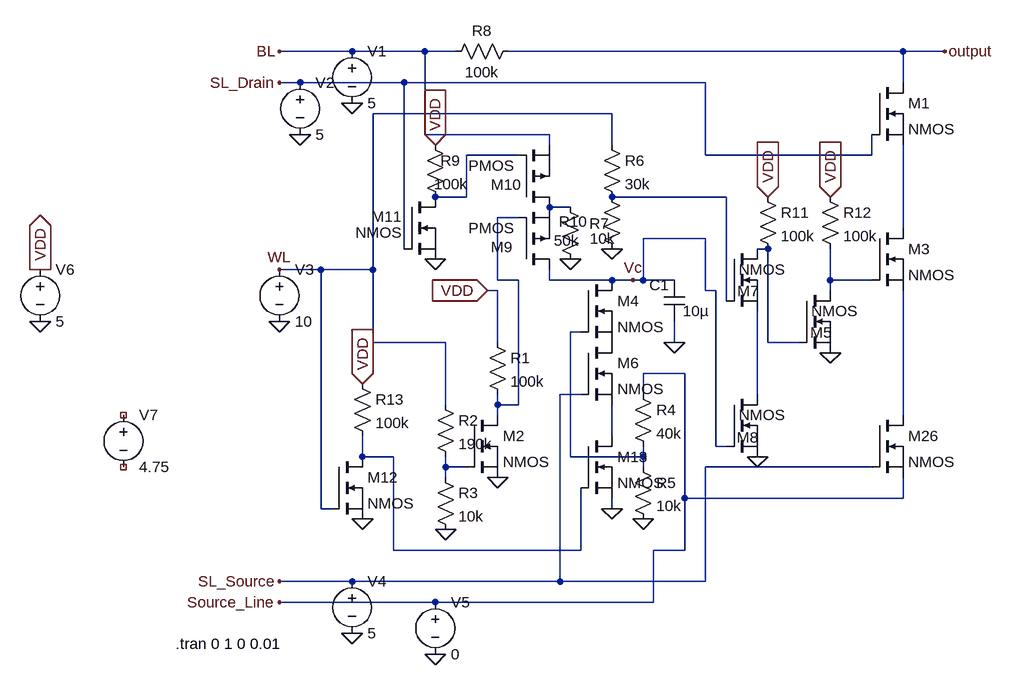
[diagram p0: schematic nand_flash_corrected.asc]
nand_flash_corrected.asc, the LTspice schematic file:
Version 4
SHEET 1 1140 836
WIRE -672 -112 -784 -112
WIRE -560 -112 -672 -112
WIRE -512 -112 -560 -112
WIRE 176 -112 -432 -112
WIRE 240 -112 176 -112
WIRE -752 -64 -784 -64
WIRE -592 -64 -752 -64
WIRE -128 -64 -592 -64
WIRE 176 -64 176 -112
WIRE -272 -16 -640 -16
WIRE -560 16 -560 -112
WIRE -368 16 -560 16
WIRE -368 32 -368 16
WIRE -272 32 -272 -16
WIRE -416 48 -496 48
WIRE -128 48 -128 -64
WIRE 128 48 128 16
WIRE 128 48 -128 48
WIRE -496 112 -496 48
WIRE -496 112 -544 112
WIRE -96 112 -272 112
WIRE -336 128 -368 128
WIRE -416 144 -448 144
WIRE 176 160 176 32
WIRE -128 176 -224 176
WIRE -592 192 -592 -64
WIRE -32 192 -48 192
WIRE -720 224 -784 224
WIRE -640 224 -640 -16
WIRE -640 224 -720 224
WIRE -448 240 -448 144
WIRE -416 240 -448 240
WIRE -368 240 -368 224
WIRE -272 240 -368 240
WIRE -240 240 -272 240
WIRE -224 240 -224 176
WIRE -224 240 -240 240
WIRE -176 240 -224 240
WIRE 64 240 64 192
WIRE 128 240 64 240
WIRE -448 256 -464 256
WIRE -128 256 -128 176
WIRE -112 256 -128 256
WIRE 64 256 64 240
WIRE -96 272 -96 112
WIRE -320 320 -336 320
WIRE -640 336 -640 224
WIRE -528 336 -640 336
WIRE -448 336 -448 256
WIRE -176 336 -176 304
WIRE -32 336 -32 192
WIRE 16 336 -32 336
WIRE -160 384 -224 384
WIRE -320 416 -352 416
WIRE -224 416 -224 384
WIRE -48 416 -48 288
WIRE -528 432 -528 336
WIRE -448 432 -448 416
WIRE -416 432 -416 240
WIRE -416 432 -448 432
WIRE -448 448 -448 432
WIRE 176 448 176 256
WIRE -272 480 -272 432
WIRE -112 496 -112 256
WIRE -96 496 -112 496
WIRE -656 512 -656 480
WIRE -608 512 -656 512
WIRE -336 512 -336 320
WIRE -224 512 -224 496
WIRE -224 512 -336 512
WIRE -528 528 -528 512
WIRE -496 528 -528 528
WIRE -224 528 -224 512
WIRE 128 528 -128 528
WIRE -528 544 -528 528
WIRE -160 576 -160 384
WIRE 176 576 176 544
WIRE 176 576 -160 576
WIRE -720 592 -720 224
WIRE -704 592 -720 592
WIRE -272 592 -272 576
WIRE -608 656 -608 512
WIRE -320 656 -320 560
WIRE -320 656 -608 656
WIRE -160 656 -160 576
WIRE -160 656 -208 656
WIRE -672 704 -784 704
WIRE -352 704 -352 416
WIRE -352 704 -672 704
WIRE -128 704 -128 528
WIRE -128 704 -352 704
WIRE -544 736 -784 736
WIRE -208 736 -208 656
WIRE -208 736 -544 736
FLAG -176 336 0
FLAG -464 256 VDD
IOPIN -464 256 In
FLAG -448 544 0
FLAG -528 624 0
FLAG -224 608 0
FLAG -272 192 0
FLAG -784 -112 BL
FLAG -784 224 WL
FLAG -784 -64 SL_Drain
FLAG -784 704 SL_Source
FLAG -784 736 Source_Line
FLAG -672 -32 0
FLAG -752 16 0
FLAG -784 304 0
FLAG -672 784 0
FLAG -544 816 0
FLAG -1152 304 0
FLAG -1152 224 VDD
IOPIN -1152 224 Out
FLAG -48 512 0
FLAG 64 352 0
FLAG -32 112 VDD
IOPIN -32 112 In
FLAG 64 112 VDD
IOPIN 64 112 In
FLAG 240 -112 output
FLAG -240 240 Vc
FLAG -544 208 0
FLAG -544 32 VDD
IOPIN -544 32 In
FLAG -336 208 0
FLAG -656 608 0
FLAG -656 400 VDD
IOPIN -656 400 In
FLAG -272 592 0
SYMBOL nmos 128 -64 R0
SYMATTR InstName M1
SYMBOL nmos 128 160 R0
SYMATTR InstName M3
SYMBOL cap -160 304 R180
WINDOW 0 24 56 Left 2
WINDOW 3 -38 16 Left 2
SYMATTR InstName C1
SYMATTR Value 10µ
SYMBOL nmos 128 448 R0
SYMATTR InstName M26
SYMBOL res -464 320 R0
SYMATTR InstName R1
SYMATTR Value 100k
SYMBOL nmos -496 448 R0
SYMATTR InstName M2
SYMBOL res -544 416 R0
SYMATTR InstName R2
SYMATTR Value 190k
SYMBOL res -544 528 R0
SYMATTR InstName R3
SYMATTR Value 10k
SYMBOL nmos -320 240 R0
SYMATTR InstName M4
SYMBOL res -240 400 R0
SYMATTR InstName R4
SYMATTR Value 40k
SYMBOL res -240 512 R0
SYMATTR InstName R5
SYMATTR Value 10k
SYMBOL res -288 16 R0
SYMATTR InstName R6
SYMATTR Value 30k
SYMBOL res -288 96 R0
WINDOW 0 -19 57 Left 2
WINDOW 3 -18 80 Left 2
SYMATTR InstName R7
SYMATTR Value 10k
SYMBOL voltage -672 -128 R0
WINDOW 123 0 0 Left 0
WINDOW 39 0 0 Left 0
SYMATTR InstName V1
SYMATTR Value 5
SYMBOL voltage -752 -80 R0
WINDOW 123 0 0 Left 0
WINDOW 39 0 0 Left 0
SYMATTR InstName V2
SYMATTR Value 5
SYMBOL voltage -784 208 R0
WINDOW 123 0 0 Left 0
WINDOW 39 0 0 Left 0
SYMATTR InstName V3
SYMATTR Value 10
SYMBOL voltage -672 688 R0
WINDOW 123 0 0 Left 0
WINDOW 39 0 0 Left 0
SYMATTR InstName V4
SYMATTR Value 5
SYMBOL voltage -544 720 R0
WINDOW 123 0 0 Left 0
WINDOW 39 0 0 Left 0
SYMATTR InstName V5
SYMATTR Value 0
SYMBOL voltage -1152 208 R0
WINDOW 123 0 0 Left 0
WINDOW 39 0 0 Left 0
SYMATTR InstName V6
SYMATTR Value 5
SYMBOL nmos -96 192 R0
WINDOW 0 17 65 Left 2
WINDOW 3 19 32 Left 2
SYMATTR InstName M7
SYMBOL nmos -96 416 R0
WINDOW 0 16 66 Left 2
WINDOW 3 19 32 Left 2
SYMATTR InstName M8
SYMBOL res -416 -128 R90
WINDOW 0 0 56 VBottom 2
WINDOW 3 32 56 VTop 2
SYMATTR InstName R8
SYMATTR Value 100k
SYMBOL res -48 96 R0
SYMATTR InstName R11
SYMATTR Value 100k
SYMBOL res 48 96 R0
SYMATTR InstName R12
SYMATTR Value 100k
SYMBOL nmos 16 256 R0
WINDOW 0 17 65 Left 2
WINDOW 3 19 32 Left 2
SYMATTR InstName M5
SYMBOL nmos -320 336 R0
SYMATTR InstName M6
SYMBOL pmos -416 224 M180
WINDOW 0 -42 35 Left 2
WINDOW 3 -77 64 Left 2
SYMATTR InstName M9
SYMBOL pmos -416 128 M180
WINDOW 0 -42 35 Left 2
WINDOW 3 -77 64 Left 2
SYMATTR InstName M10
SYMBOL nmos -592 112 R0
WINDOW 0 -50 30 Left 2
WINDOW 3 -75 55 Left 2
SYMATTR InstName M11
SYMBOL res -560 16 R0
WINDOW 0 24 40 Left 2
WINDOW 3 14 76 Left 2
SYMATTR InstName R9
SYMATTR Value 100k
SYMBOL res -352 112 R0
WINDOW 0 -2 38 Left 2
WINDOW 3 -9 67 Left 2
SYMATTR InstName R10
SYMATTR Value 50k
SYMBOL voltage -1024 432 R0
WINDOW 123 0 0 Left 0
WINDOW 39 0 0 Left 0
SYMATTR InstName V7
SYMATTR Value 4.75
SYMBOL nmos -704 512 R0
SYMATTR InstName M12
SYMBOL res -672 384 R0
SYMATTR InstName R13
SYMATTR Value 100k
SYMBOL nmos -320 480 R0
SYMATTR InstName M13
TEXT -944 800 Left 2 !.tran 0 1 0 0.01

The netlist it stands for:
* nand_flash_corrected.asc
M1 output SL_Drain N005 N005 NMOS
M3 N005 N007 N010 N010 NMOS
C1 0 Vc 10µ
M26 N010 SL_Source Source_Line Source_Line NMOS
R1 VDD N004 100k
M2 N004 N013 0 0 NMOS
R2 WL N013 190k
R3 N013 0 10k
M4 Vc N008 P001 P001 NMOS
R4 Source_Line N008 40k
R5 N008 0 10k
R6 WL N002 30k
R7 N002 0 10k
V1 BL 0 5
V2 SL_Drain 0 5
V3 WL 0 10
V4 SL_Source 0 5
V5 Source_Line 0 0
V6 VDD 0 5
M7 N006 N002 N009 N009 NMOS
M8 N009 Vc 0 0 NMOS
R8 output BL 100k
R11 VDD N006 100k
R12 VDD N007 100k
M5 N007 N006 0 0 NMOS
M6 P001 SL_Source N011 N011 NMOS
M9 Vc N004 N003 N003 PMOS
M10 N003 N001 BL BL PMOS
M11 N001 SL_Drain 0 0 NMOS
R9 VDD N001 100k
R10 N003 0 50k
V7 NC_01 NC_02 4.75
M12 N012 WL 0 0 NMOS
R13 VDD N012 100k
M13 N011 N012 0 0 NMOS
.model NMOS NMOS
.model PMOS PMOS
.lib standard.mos
.tran 0 1 0 0.01
.backanno
.end